# EAGLE design automatic board (EAGLE 7.5.0)
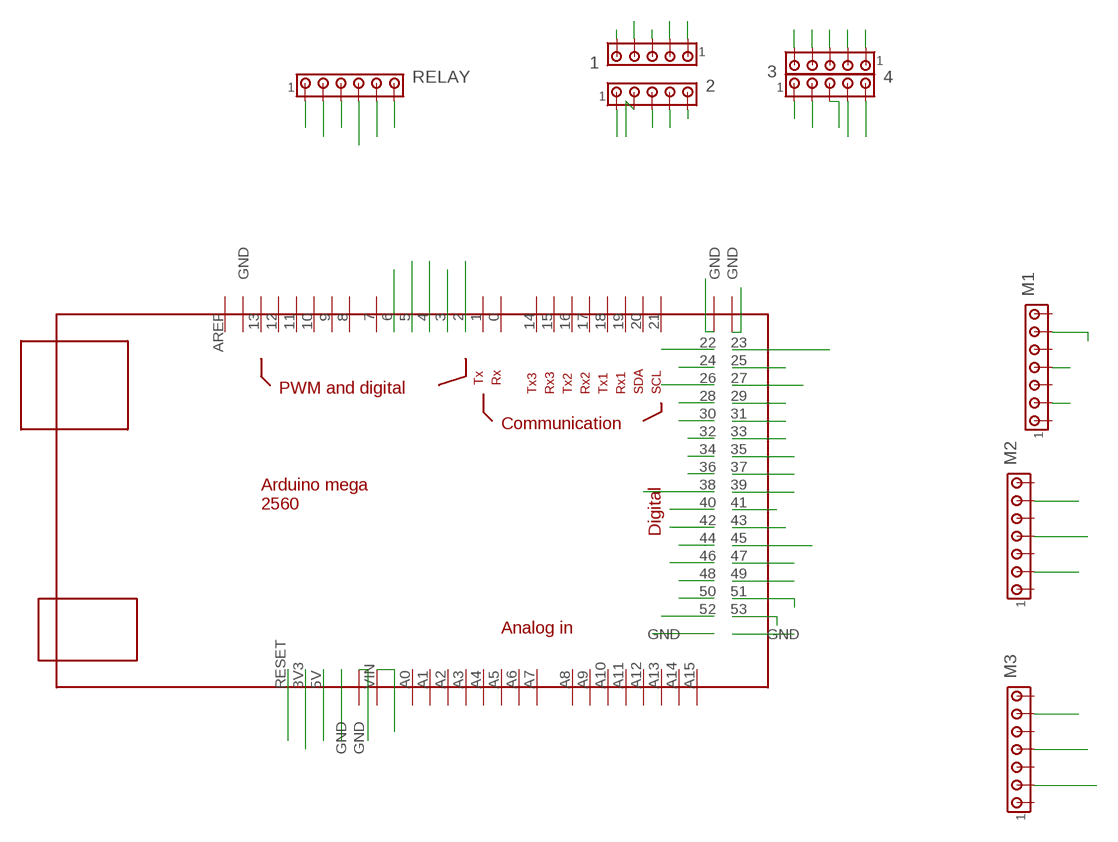
[diagram p0: schematic, sheet 1]

## Parts
1  MTA05-100  [10X05MTA]
2  MTA05-100  [10X05MTA]
3  MTA05-100  [10X05MTA]
4  MTA05-100  [10X05MTA]
M1  MTA07-100  [10X07MTA]
M2  MTA07-100  [10X07MTA]
M3  MTA07-100  [10X07MTA]
RELAY  MTA06-100  [10X06MTA]
U$1  MEGA_DEVICE  [MEGAOUTLINE]

## Nets
2: M3.4 U$1.2
3: M2.4 U$1.3
3.3: U$1.3V3
4: M1.4 U$1.4
5: U$1.5
6: U$1.6
22: M1.2 U$1.22
23: 1.5 U$1.23
24: M1.6 U$1.24
25: 1.4 U$1.25
26: M2.2 U$1.26
27: 1.3 U$1.27
28: M2.6 U$1.28
29: 1.2 U$1.29
30: M3.2 U$1.30
31: 2.4 U$1.31
32: M3.6 U$1.32
33: 2.3 U$1.33
34: RELAY.2 U$1.34
35: 2.2 U$1.35
36: RELAY.3 U$1.36
37: 2.1 U$1.37
38: RELAY.4 U$1.38
39: 3.5 U$1.39
40: RELAY.5 U$1.40
41: 3.4 U$1.41
42: U$1.42
43: 3.3 U$1.43
44: U$1.44
45: 3.2 U$1.45
46: U$1.46
47: 4.4 U$1.47
48: U$1.48
49: 4.3 U$1.49
50: U$1.50
51: 4.2 U$1.51
52: 4.1 U$1.52
53: U$1.53
GND: 1.1 3.1 RELAY.6 U$1.GND@2(GND) U$1.GND@3(GND) U$1.GND@6(GND) U$1.GND@7(GND)
RESET: U$1.RESET
VCC1: RELAY.1 U$1.5V
VCC2: U$1.GND@4(GND)
VCC3: 2.5 4.5 U$1.GND@5(GND)
VIN: U$1.VIN
Unconnected: M1.1 M1.3 M1.5 M1.7 M2.1 M2.3 M2.5 M2.7 M3.1 M3.3 M3.5 M3.7 U$1.0 U$1.1 U$1.7 U$1.8 U$1.9 U$1.10 U$1.11 U$1.12 U$1.13 U$1.14 U$1.15 U$1.16 U$1.17 U$1.18 U$1.19 U$1.20 U$1.21 U$1.A0 U$1.A1 U$1.A2 U$1.A3 U$1.A4 U$1.A5 U$1.A6 U$1.A7 U$1.A8 U$1.A9 U$1.A10 U$1.A11 U$1.A12 U$1.A13 U$1.A14 U$1.A15 U$1.AREF U$1.GND@1(GND)

## Library data of the parts
1-4 = con-amp:MTA05-100: AMP connector
M1-M3 = con-amp:MTA07-100: AMP connector
RELAY = con-amp:MTA06-100: AMP connector Connection corrected 2014-09-19
U$1 = ArduinoMegaOutline:MEGA_DEVICE: mega card as device

## Board
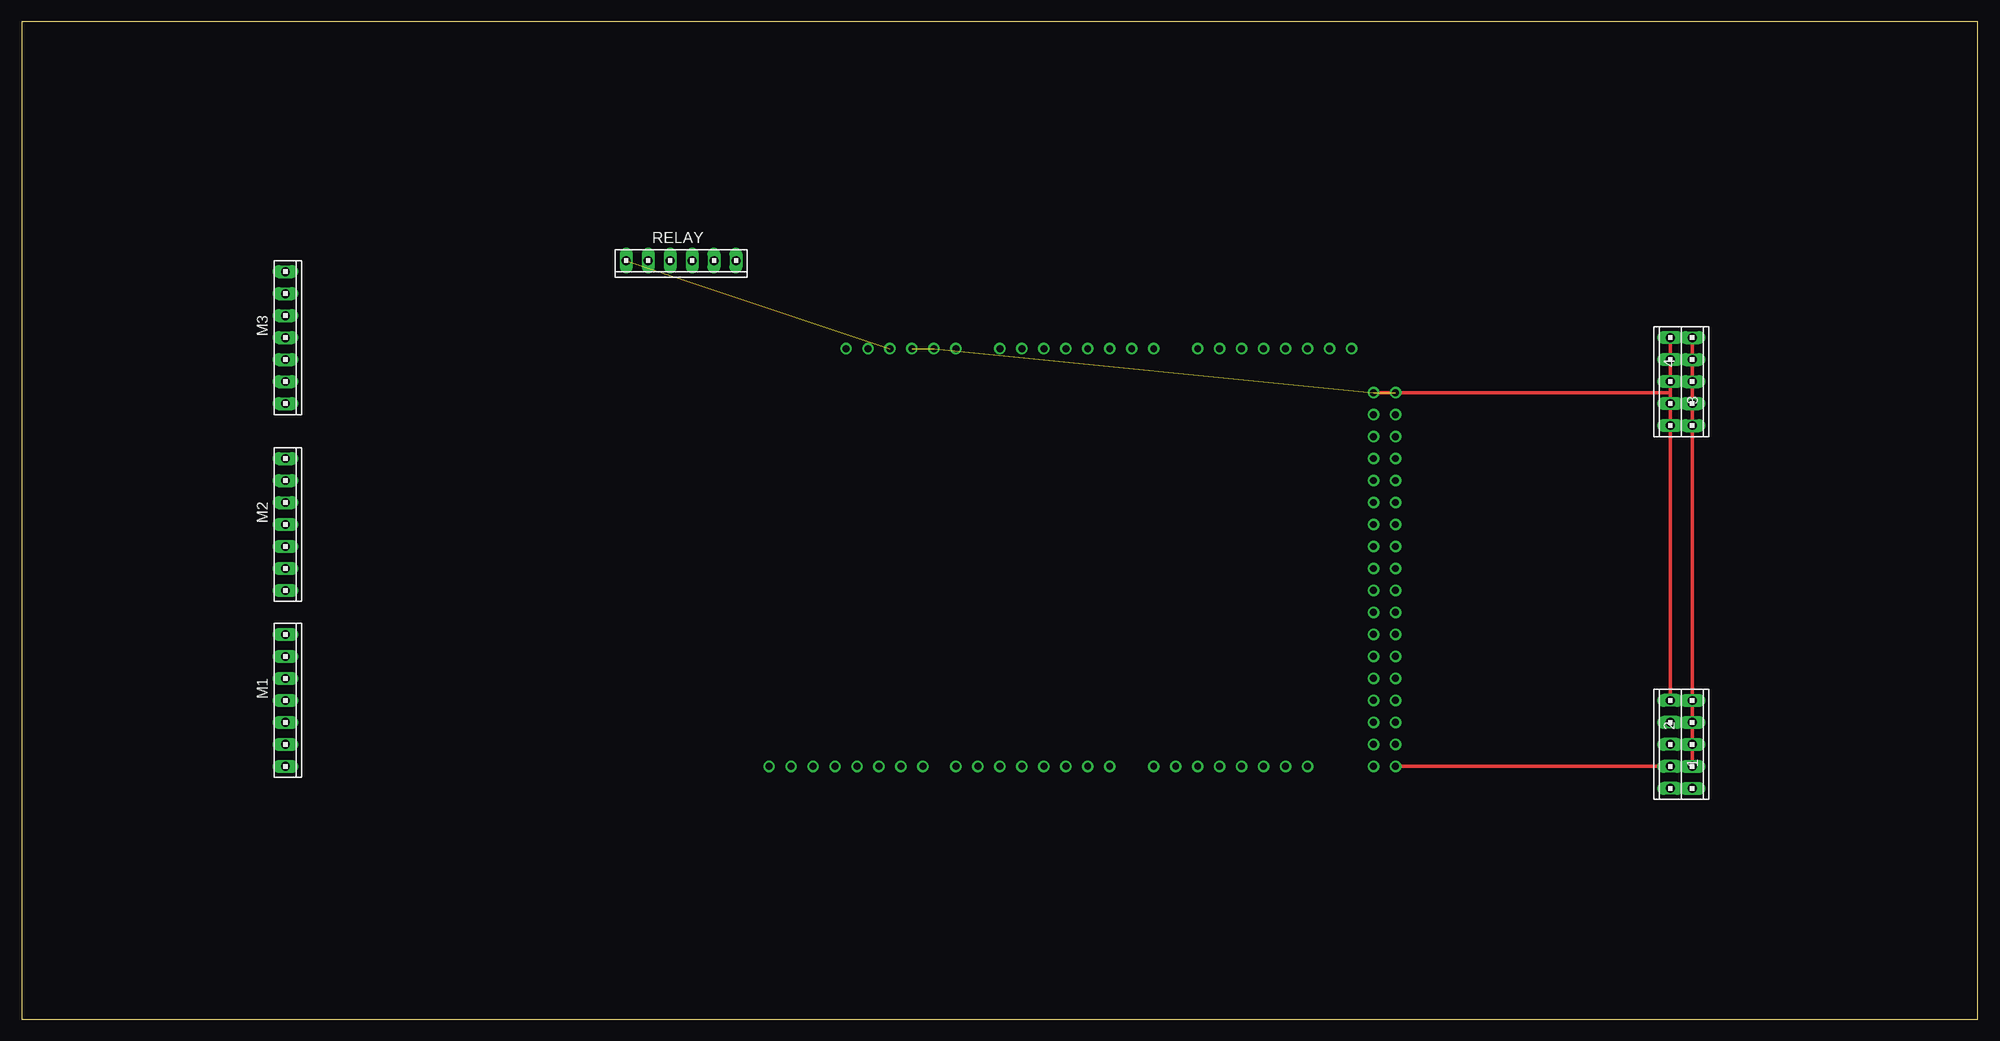
[diagram p1: board, top side]
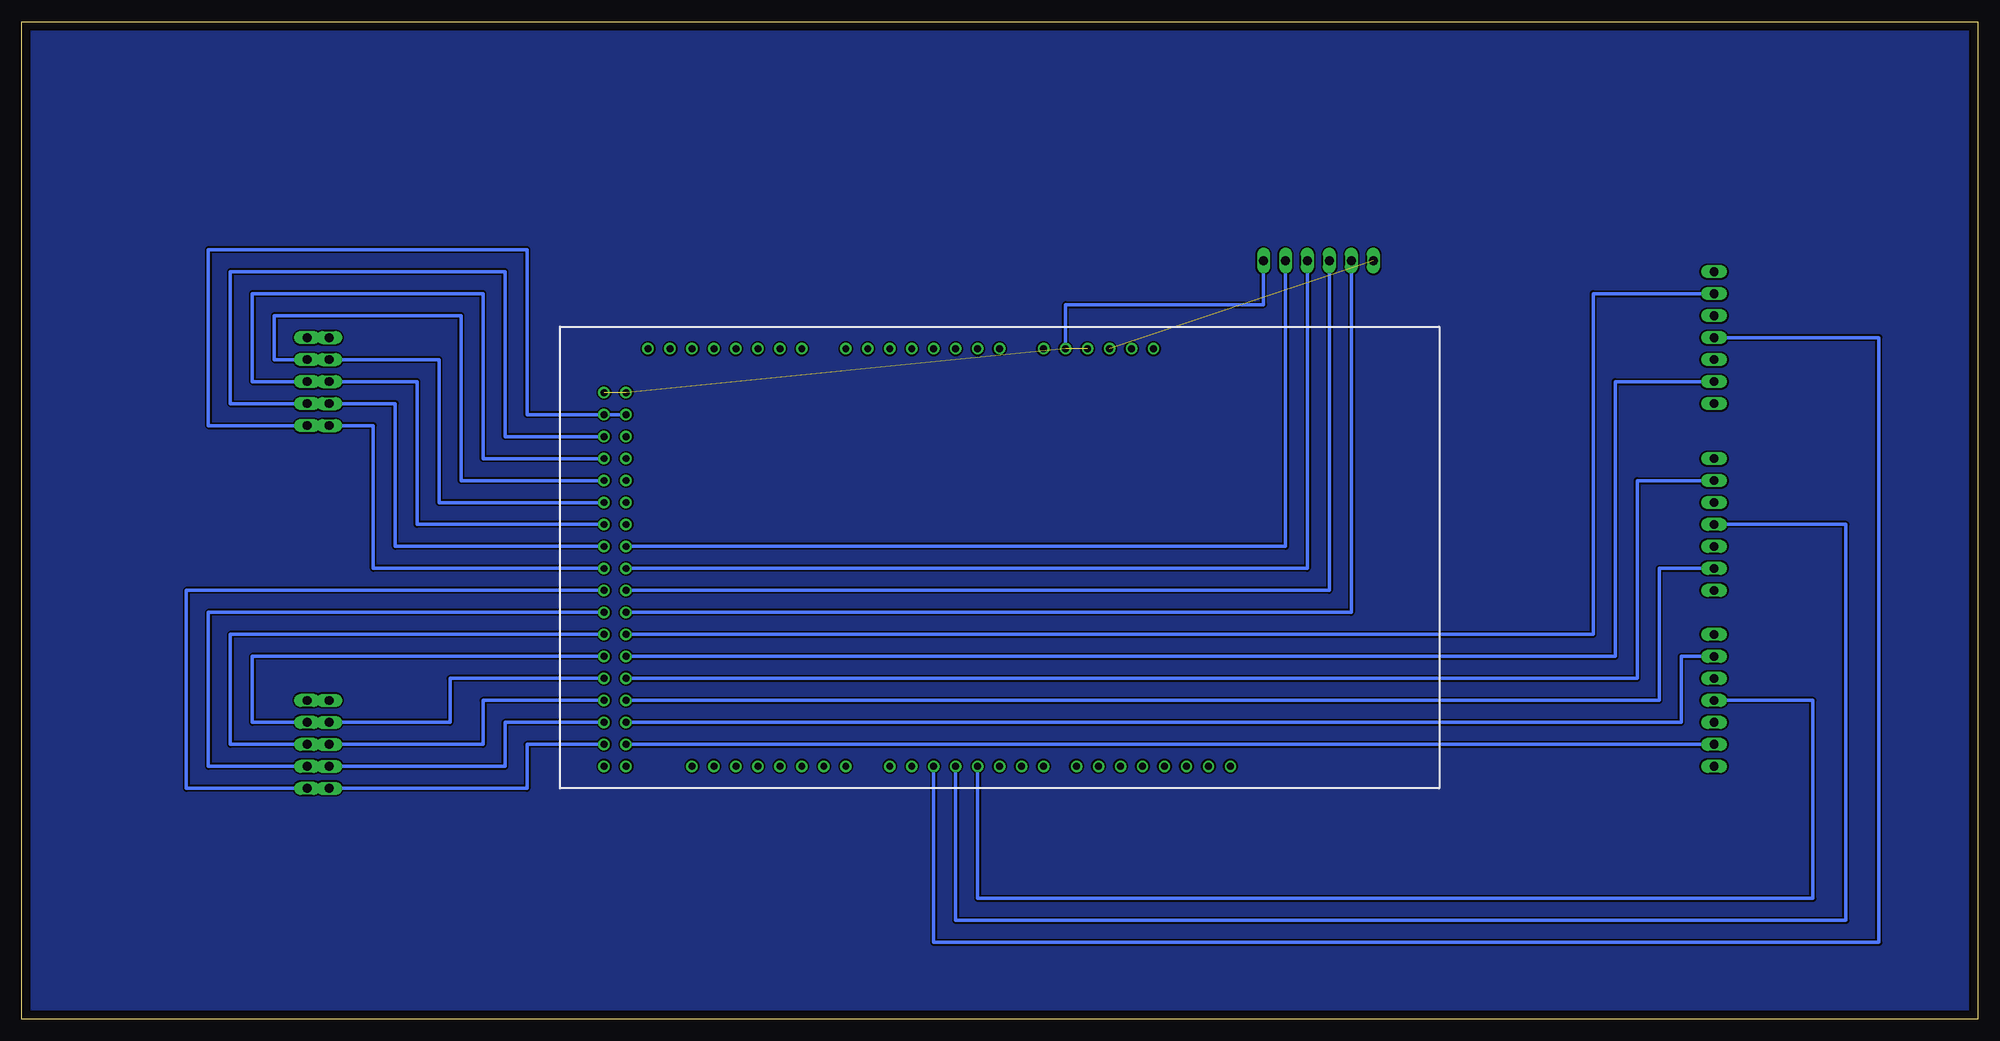
[diagram p2: board, bottom side, seen from below]

Size 226.04 x 115.24 mm. Coordinates in mm from the lower left corner, seen from the top.
Outline: 0,0 226.04,0 226.04,115.24 0,115.24 0,0
Copper layers (1*16): Top 0.035mm / dielectric 1.5mm / Bottom 0.035mm
Design rules "default": minimum track width 10mil, minimum drill 24mil, track to track 8mil, track to pad 8mil, pad to pad 8mil, via to via 8mil, smd to smd 8mil, copper to edge 40mil, drill to drill 8mil, minimum pad ring 10mil, minimum via ring 8mil, stop-mask expansion 4mil, vias tented up to drill 0mil, thermal gap 10mil

### Footprints (pad centres in the part's own frame; a part is rotated, then mirrored left to right if it is on the bottom)
10X05MTA = drill 1.016 long: 1 5.08,0; 2 2.54,0; 3 0,0; 4 -2.54,0; 5 -5.08,0
10X07MTA = drill 1.016 long: 1 7.62,0; 2 5.08,0; 3 2.54,0; 4 0,0; 5 -2.54,0; 6 -5.08,0; 7 -7.62,0
10X06MTA = drill 1.016 long: 1 6.35,0; 2 3.81,0; 3 1.27,0; 4 -1.27,0; 5 -3.81,0; 6 -6.35,0
MEGAOUTLINE = drill 0.8: 0 12.7,24.13; 1 10.16,24.13; 2 7.62,24.13; 3 5.08,24.13; 3V3 -15.24,-24.13; 4 2.54,24.13; 5 0,24.13; 5V -12.7,-24.13; 6 -2.54,24.13; 7 -5.08,24.13; 8 -8.89,24.13; 9 -11.43,24.13; 10 -13.97,24.13; 11 -16.51,24.13; 12 -19.05,24.13; 13 -21.59,24.13; 14 17.78,24.13; 15 20.32,24.13; 16 22.86,24.13; 17 25.4,24.13; 18 27.94,24.13; 19 30.48,24.13; 20 33.02,24.13; 21 35.56,24.13; 22 43.18,21.59; 23 45.72,21.59; 24 43.18,19.05; 25 45.72,19.05; 26 43.18,16.51; 27 45.72,16.51; 28 43.18,13.97; 29 45.72,13.97; 30 43.18,11.43; 31 45.72,11.43; 32 43.18,8.89; 33 45.72,8.89; 34 43.18,6.35; 35 45.72,6.35; 36 43.18,3.81; 37 45.72,3.81; 38 43.18,1.27; 39 45.72,1.27; 40 43.18,-1.27; 41 45.72,-1.27; 42 43.18,-3.81; 43 45.72,-3.81; 44 43.18,-6.35; 45 45.72,-6.35; 46 43.18,-8.89; 47 45.72,-8.89; 48 43.18,-11.43; 49 45.72,-11.43; 50 43.18,-13.97; 51 45.72,-13.97; 52 43.18,-16.51; 53 45.72,-16.51; A0 0,-24.13; A1 2.54,-24.13; A2 5.08,-24.13; A3 7.62,-24.13; A4 10.16,-24.13; A5 12.7,-24.13; A6 15.24,-24.13; A7 17.78,-24.13; A8 22.86,-24.13; A9 25.4,-24.13; A10 27.94,-24.13; A11 30.48,-24.13; A12 33.02,-24.13; A13 35.56,-24.13; A14 38.1,-24.13; A15 40.64,-24.13; AREF -26.67,24.13; GND@1 -24.13,24.13; GND@2 -10.16,-24.13; GND@3 -7.62,-24.13; GND@4 43.18,24.13; GND@5 45.72,24.13; GND@6 43.18,-19.05; GND@7 45.72,-19.05; RESET -17.78,-24.13; VIN -5.08,-24.13

### Placement (x,y rotation side)
1  190.5,31.75 90 top
2  193.04,31.75 270 top
3  190.5,73.66 90 top
4  193.04,73.66 270 top
M1  30.48,36.83 270 top
M2  30.48,57.15 270 top
M3  30.48,78.74 270 top
RELAY  76.2,87.63 180 top
U$1  113.03,53.34 180 bottom

### Tracks (layer width: path | path; a pad name or v marks a point on that pad's centre or on a via)
2
  Bottom 0.406: U$1.2 120.65,8.89 11.43,8.89 11.43,78.74 M3.4
3
  Bottom 0.406: U$1.3 118.11,11.43 15.24,11.43 15.24,57.15 M2.4
4
  Bottom 0.406: U$1.4 115.57,13.97 19.05,13.97 19.05,36.83 M1.4
22
  Bottom 0.406: U$1.22 M1.2
23
  Bottom 0.406: U$1.23 167.64,31.75 167.64,26.67 1.5
24
  Bottom 0.406: U$1.24 34.29,34.29 34.29,41.91 M1.6
25
  Bottom 0.406: U$1.25 170.18,34.29 170.18,29.21 1.4
26
  Bottom 0.406: U$1.26 36.83,36.83 36.83,52.07 M2.2
27
  Bottom 0.406: U$1.27 172.72,36.83 172.72,31.75 1.3
28
  Bottom 0.406: U$1.28 39.37,39.37 39.37,62.23 M2.6
29
  Bottom 0.406: U$1.29 176.53,39.37 176.53,34.29 1.2
30
  Bottom 0.406: U$1.30 41.91,41.91 41.91,73.66 M3.2
31
  Bottom 0.406: U$1.31 199.39,41.91 199.39,34.29 2.4
32
  Bottom 0.406: U$1.32 44.45,44.45 44.45,83.82 M3.6
33
  Bottom 0.406: U$1.33 201.93,44.45 201.93,31.75 2.3
34
  Bottom 0.406: RELAY.2 72.39,46.99 U$1.34
35
  Bottom 0.406: U$1.35 204.47,46.99 204.47,29.21 2.2
36
  Bottom 0.406: RELAY.3 74.93,49.53 U$1.36
37
  Bottom 0.406: U$1.37 207.01,49.53 207.01,26.67 2.1
38
  Bottom 0.406: RELAY.4 77.47,52.07 U$1.38
39
  Bottom 0.406: U$1.39 185.42,52.07 185.42,68.58 3.5
40
  Bottom 0.406: RELAY.5 80.01,54.61 U$1.40
41
  Bottom 0.406: U$1.41 182.88,54.61 182.88,71.12 3.4
43
  Bottom 0.406: U$1.43 180.34,57.15 180.34,73.66 3.3
45
  Bottom 0.406: U$1.45 177.8,59.69 177.8,76.2 3.2
47
  Bottom 0.406: U$1.47 175.26,62.23 175.26,81.28 196.85,81.28 196.85,76.2 4.4
49
  Bottom 0.406: U$1.49 172.72,64.77 172.72,83.82 199.39,83.82 199.39,73.66 4.3
51
  Bottom 0.406: U$1.51 170.18,67.31 170.18,86.36 201.93,86.36 201.93,71.12 4.2
52
  Bottom 0.406: U$1.52 167.64,69.85 167.64,88.9 204.47,88.9 204.47,68.58 4.1
GND  (3 unrouted)
  Top 0.406: U$1.GND@6 190.5,72.39 3.1 1.1
  Bottom 0.406: U$1.GND@3 105.41,82.55 82.55,82.55 RELAY.6
N$1
  pour Bottom: 0,115.57 0,0 226.06,0 226.06,5.08 226.06,115.57
VCC1  (1 unrouted)
VCC3
  Top 0.406: U$1.GND@5 193.04,29.21 2.5 4.5